# EAGLE design R650X (EAGLE 6.6.0)
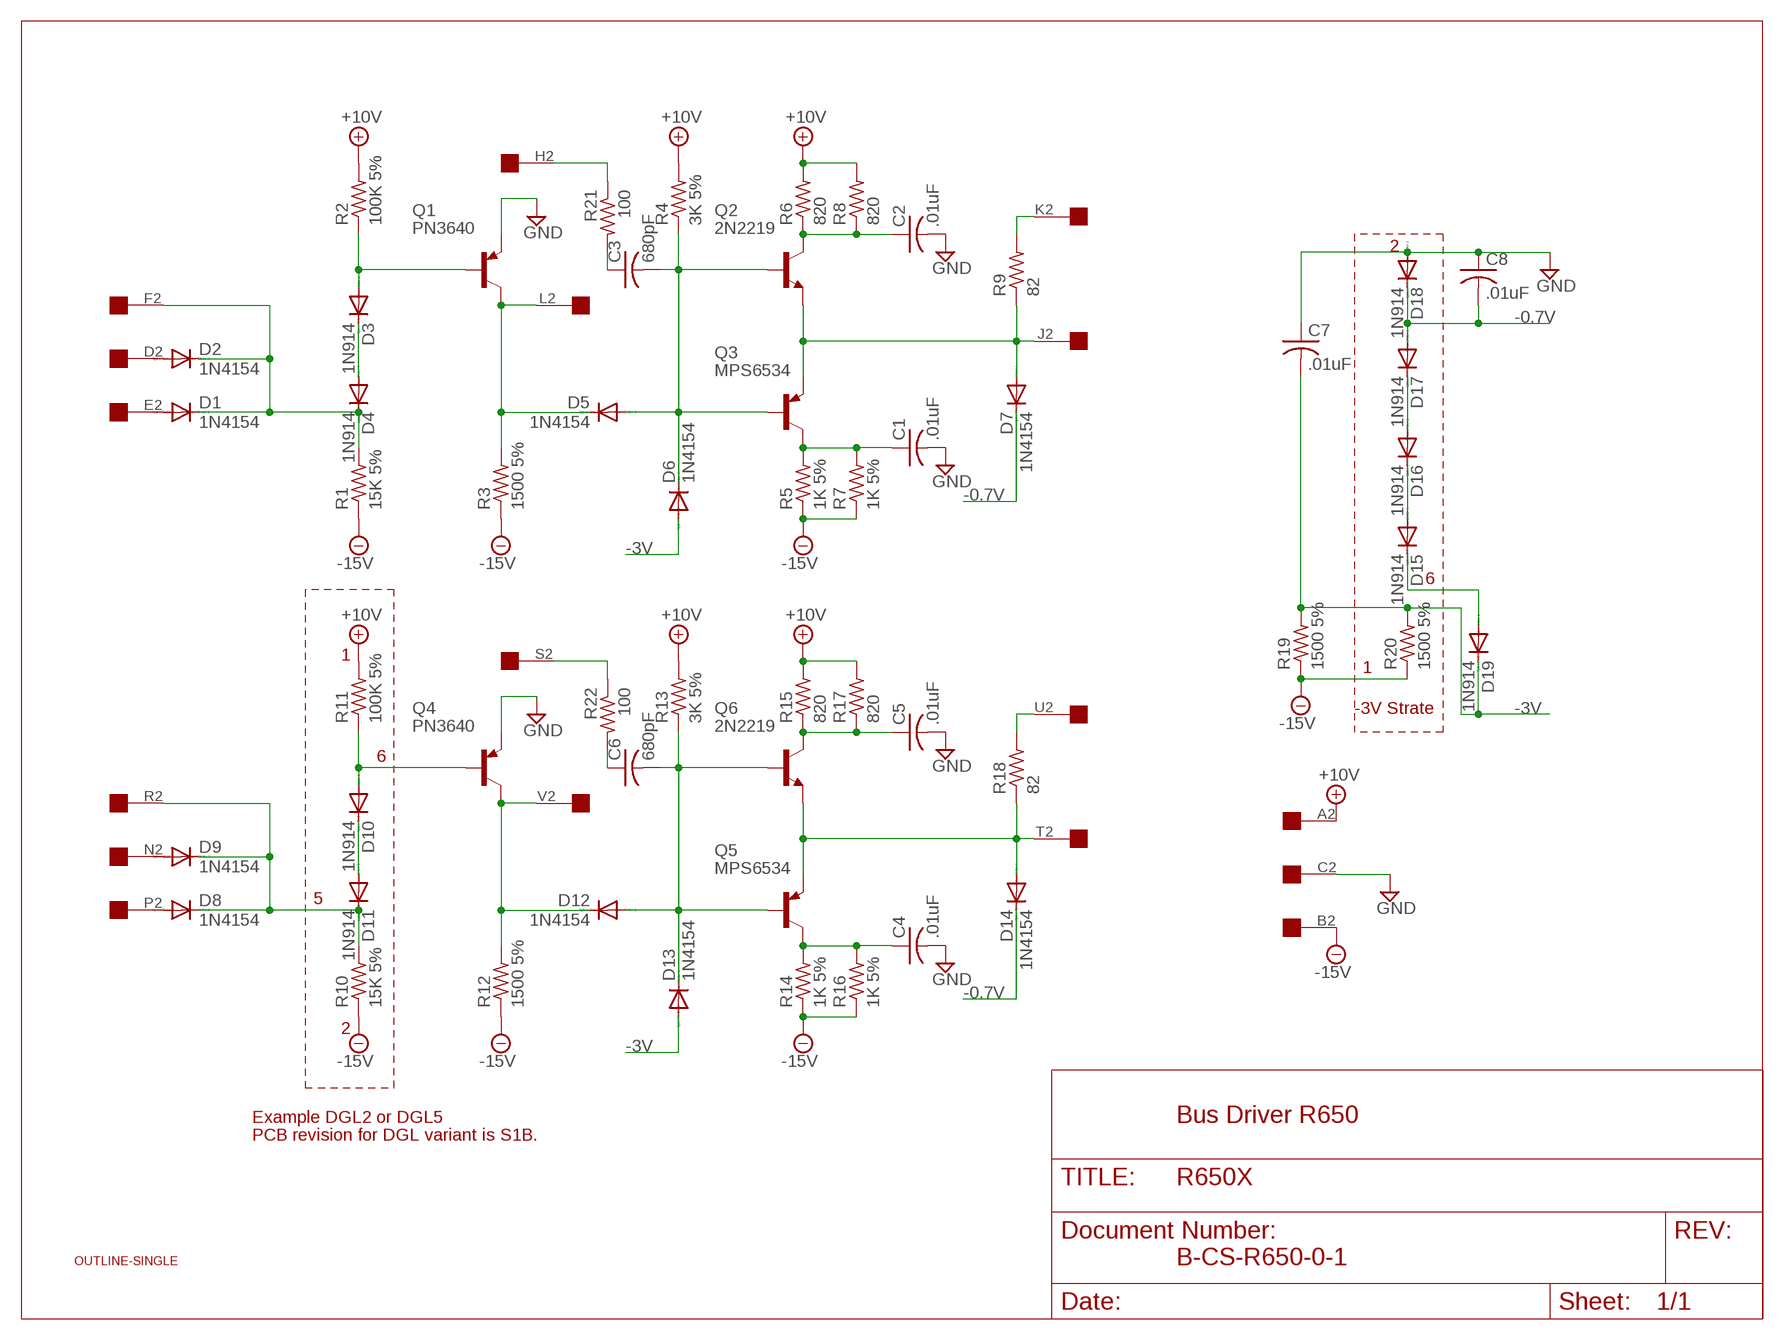
[diagram p0: schematic, sheet 1]

## Parts
C1  .01uF  C-US102-043X133  [C102-043X133]
C2  .01uF  C-US102-043X133  [C102-043X133]
C3  680pF  C-US102-043X133  [C102-043X133]
C4  .01uF  C-US102-043X133  [C102-043X133]
C5  .01uF  C-US102-043X133  [C102-043X133]
C6  680pF  C-US102-043X133  [C102-043X133]
C7  .01uF  C-US102-043X133  [C102-043X133]
C8  .01uF  C-US102-043X133  [C102-043X133]
D1  1N4154  1N4148DO35-10  [DO35-10]
D2  1N4154  1N4148DO35-10  [DO35-10]
D3  1N914  1N4148DO35-10  [DO35-10]
D4  1N914  1N4148DO35-10  [DO35-10]
D5  1N4154  1N4148DO35-10  [DO35-10]
D6  1N4154  1N4148DO35-10  [DO35-10]
D7  1N4154  1N4148DO35-10  [DO35-10]
D8  1N4154  1N4148DO35-10  [DO35-10]
D9  1N4154  1N4148DO35-10  [DO35-10]
D10  1N914  1N4148DO35-10  [DO35-10]
D11  1N914  1N4148DO35-10  [DO35-10]
D12  1N4154  1N4148DO35-10  [DO35-10]
D13  1N4154  1N4148DO35-10  [DO35-10]
D14  1N4154  1N4148DO35-10  [DO35-10]
D15  1N914  1N4148DO35-10  [DO35-10]
D16  1N914  1N4148DO35-10  [DO35-10]
D17  1N914  1N4148DO35-10  [DO35-10]
D18  1N914  1N4148DO35-10  [DO35-10]
D19  1N914  1N4148DO35-10  [DO35-10]
Q1  PN3640  2N3637  [TO39]
Q2  2N2219  [TO5]
Q3  MPS6534  2N3637  [TO39]
Q4  PN3640  2N3637  [TO39]
Q5  MPS6534  2N3637  [TO39]
Q6  2N2219  [TO5]
R1  15K 5%  R-US_0207/10  [0207/10]
R2  100K 5%  R-US_0207/10  [0207/10]
R3  1500 5%  R-US_0207/10  [0207/10]
R4  3K 5%  R-US_0207/10  [0207/10]
R5  1K 5%  R-US_0207/10  [0207/10]
R6  820  R-US_0207/10  [0207/10]
R7  1K 5%  R-US_0207/10  [0207/10]
R8  820  R-US_0207/10  [0207/10]
R9  82  R-US_0207/10  [0207/10]
R10  15K 5%  R-US_0207/10  [0207/10]
R11  100K 5%  R-US_0207/10  [0207/10]
R12  1500 5%  R-US_0207/10  [0207/10]
R13  3K 5%  R-US_0207/10  [0207/10]
R14  1K 5%  R-US_0207/10  [0207/10]
R15  820  R-US_0207/10  [0207/10]
R16  1K 5%  R-US_0207/10  [0207/10]
R17  820  R-US_0207/10  [0207/10]
R18  82  R-US_0207/10  [0207/10]
R19  1500 5%  R-US_0207/10  [0207/10]
R20  1500 5%  R-US_0207/10  [0207/10]
R21  100  R-US_0207/10  [0207/10]
R22  100  R-US_0207/10  [0207/10]
U$1  OUTLINE-SINGLE  [SINGLE]
U$2  EDGE-1  [EDGE-CON1]

## Nets
+10V [Power]: R2.2 R4.2 R6.2 R8.2 R11.2 R13.2 R15.2 R17.2 U$2.A2
-0.7V [Power]: C8.2 D7.C D14.C D17.A D18.C
-3V [Power]: C7.2 D6.A D13.A D19.C R19.2 R20.2
-15V [Power]: R1.1 R3.1 R5.1 R7.1 R10.1 R12.1 R14.1 R16.1 R19.1 R20.1 U$2.B2
GND [Power]: C1.2 C2.2 C4.2 C5.2 C7.1 C8.1 D18.A Q1.1(E) Q4.1(E) U$2.C2
N$1: C3.2 D5.A D6.C Q2.2(B) Q3.2(B) R4.1
N$2: D7.A Q2.1(E) Q3.1(E) R9.1 U$2.J2
N$3: R9.2 U$2.K2
N$5: D5.C Q1.3(C) R3.2 U$2.L2
N$6: C2.1 Q2.3(C) R6.1 R8.1
N$7: C1.1 Q3.3(C) R5.2 R7.2
N$8: D10.A Q4.2(B) R11.1
N$9: D12.C Q4.3(C) R12.2 U$2.V2
N$10: D8.C D9.C D11.C R10.2 U$2.R2
N$11: D10.C D11.A
N$13: D16.A D17.C
N$14: R21.1 U$2.H2
N$15: C3.1 R21.2
N$16: D15.A D16.C
N$17: C6.2 D12.A D13.C Q5.2(B) Q6.2(B) R13.1
N$18: D14.A Q5.1(E) Q6.1(E) R18.1 U$2.T2
N$19: D3.A Q1.2(B) R2.1
N$21: D1.A U$2.E2
N$22: D1.C D2.C D4.C R1.2 U$2.F2
N$23: D3.C D4.A
N$25: C5.1 Q6.3(C) R15.1 R17.1
N$26: C4.1 Q5.3(C) R14.2 R16.2
N$27: R18.2 U$2.U2
N$28: R22.1 U$2.S2
N$29: C6.1 R22.2
N$30: D9.A U$2.N2
N$31: D8.A U$2.P2
N$34: D15.C D19.A
N$39: D2.A U$2.D2
Unconnected: U$2.M2

## Notes on the sheet
- 2
- 6
- 1 | 1
- -3V Strate
- 6
- 5
- 2
- Example DGL2 or DGL5 | Bus Driver R650
- PCB revision for DGL variant is S1B.
- B-CS-R650-0-1

## Library data of the parts
C1-C8 = rcl:C-US: CAPACITOR, American symbol
D1-D19 = diode:1N4148: DIODE high speed (Philips)
Q1 Q3-Q5 = transistor-pnp:2N3637*: PNP Transistror
Q2 Q6 = transistor:2N2219: NPN TRANSISTOR
R1-R22 = rcl:R-US_: RESISTOR, American symbol
U$1 = dec-con:OUTLINE-*: Board outlines for DEC boards.
U$2 = dec-con:EDGE-1: Single-Sided DEC Edge Connector -- (side 2)

## Net classes
1 Power: width 0.813 mm

## Board
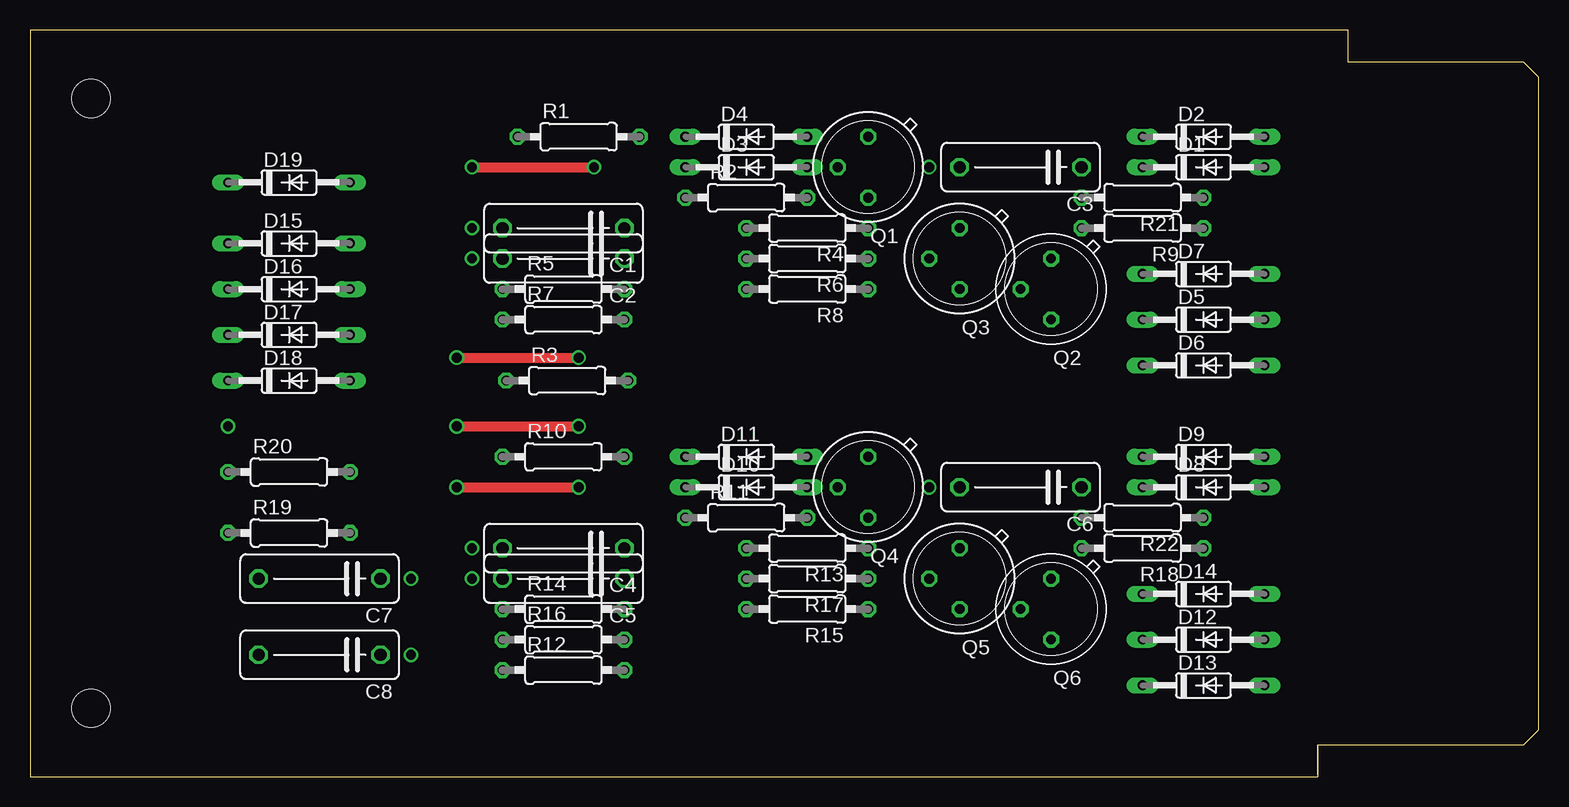
[diagram p1: board, top side]
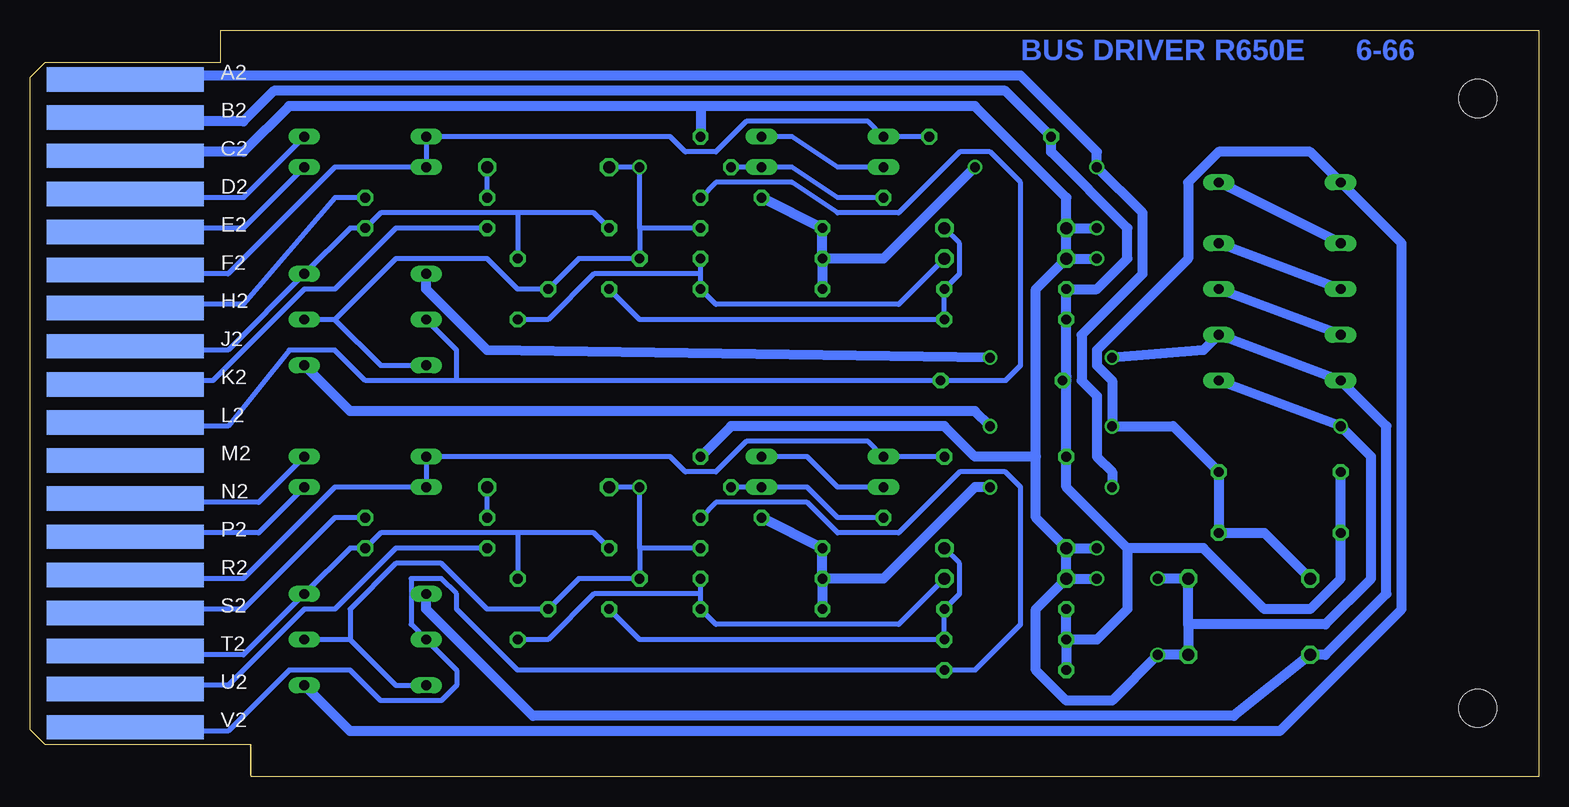
[diagram p2: board, bottom side, seen from below]

Size 125.73 x 62.23 mm. Coordinates in mm from the lower left corner, seen from the top.
Copper layers (1+16): Top 0.035mm / dielectric 1.5mm / Bottom 0.035mm
Design rules "16mils": minimum track width 16mil, minimum drill 32mil, track to track 15mil, track to pad 10mil, pad to pad 10mil, via to via 10mil, smd to smd 10mil, copper to edge 13mil, drill to drill 10mil, minimum pad ring 10mil, minimum via ring 8mil, stop-mask expansion 0mil, vias tented up to drill 0mil, thermal gap 10mil

### Footprints (pad centres in the part's own frame; a part is rotated, then mirrored left to right if it is on the bottom)
C102-043X133 = drill 1.016 octagon: 1 -5.08,0; 2 5.08,0
DO35-10 = drill 0.813 long: A 5.08,0; C -5.08,0
TO39 = drill 0.813 octagon: 1 0,-2.54; 2 2.54,0; 3 0,2.54
TO5 = drill 0.813 octagon: 1 0,-2.54; 2 2.54,0; 3 0,2.54
0207/10 = drill 0.813 octagon: 1 -5.08,0; 2 5.08,0
SINGLE = hole 3.175: 120.65,56.515; 120.65,5.715
EDGE-CON1 = smd 13.106 x 2.032 bottom: A2 7.938,4.128; B2 7.938,7.303; C2 7.938,10.477; D2 7.938,13.652; E2 7.938,16.828; F2 7.938,20.003; H2 7.938,23.177; J2 7.938,26.352; K2 7.938,29.527; L2 7.938,32.703; M2 7.938,35.877; N2 7.938,39.053; P2 7.938,42.227; R2 7.938,45.403; S2 7.938,48.578; T2 7.938,51.752; U2 7.938,54.928; V2 7.938,58.102

### Placement (x,y rotation side)
C1  44.45,45.72 180 top
C2  44.45,43.18 180 top
C3  82.55,50.8 180 top
C4  44.45,19.05 180 top
C5  44.45,16.51 180 top
C6  82.55,24.13 180 top
C7  24.13,16.51 180 top
C8  24.13,10.16 180 top
D1  97.79,50.8 0 top
D2  97.79,53.34 0 top
D3  59.69,50.8 0 top
D4  59.69,53.34 0 top
D5  97.79,38.1 0 top
D6  97.79,34.29 0 top
D7  97.79,41.91 0 top
D8  97.79,24.13 0 top
D9  97.79,26.67 0 top
D10  59.69,24.13 0 top
D11  59.69,26.67 0 top
D12  97.79,11.43 0 top
D13  97.79,7.62 0 top
D14  97.79,15.24 0 top
D15  21.59,44.45 0 top
D16  21.59,40.64 0 top
D17  21.59,36.83 0 top
D18  21.59,33.02 0 top
D19  21.59,49.53 0 top
Q1  69.85,50.8 180 top
Q2  85.09,40.64 180 top
Q3  77.47,43.18 180 top
Q4  69.85,24.13 180 top
Q5  77.47,16.51 180 top
Q6  85.09,13.97 180 top
R1  45.72,53.34 0 top
R2  59.69,48.26 0 top
R3  44.77,33.02 0 top
R4  64.77,45.72 180 top
R5  44.45,40.64 0 top
R6  64.77,43.18 180 top
R7  44.45,38.1 0 top
R8  64.77,40.64 180 top
R9  92.71,45.72 180 top
R10  44.45,26.67 0 top
R11  59.69,21.59 0 top
R12  44.45,8.89 0 top
R13  64.77,19.05 180 top
R14  44.45,13.97 0 top
R15  64.77,13.97 180 top
R16  44.45,11.43 0 top
R17  64.77,16.51 180 top
R18  92.71,19.05 180 top
R19  21.59,20.32 0 top
R20  21.59,25.4 0 top
R21  92.71,48.26 180 top
R22  92.71,21.59 180 top
U$1  125.73,62.23 180 top
U$2  125.73,62.23 180 top

### Tracks (layer width: path | path; a pad name or v marks a point on that pad's centre or on a via)
+10V  (via drill 0.81)
  Top 0.813: v36.83,50.8 v46.99,50.8 | v35.56,24.13 v45.72,24.13
  Bottom 0.813: R2.2 R4.2 R6.2 | R6.2 R8.2 | U$2.A2 116.84,58.42 43.18,58.42 36.83,52.07 v36.83,50.8 33.02,46.99 33.02,41.91 38.1,36.83 38.1,33.02 36.83,31.75 36.83,26.67 35.56,25.4 v35.56,24.13 | v46.99,50.8 54.61,43.18 R6.2 | R11.2 R13.2 R17.2 | R17.2 R15.2 | v45.72,24.13 46.99,24.13 54.61,16.51 R17.2
-0.7V  (via drill 0.81)
  Top 0.813: v35.56,34.92 v45.72,34.92
  Bottom 0.813: v35.56,34.92 27.94,35.56 D17.A D18.C 12.7,29.21 12.7,15.24 17.78,10.16 C8.2 25.4,5.08 83.82,5.08 92.71,13.97 D14.C | v45.72,34.92 87.63,35.56 92.71,40.64 D7.C
-3V  (via drill 0.81)
  Top 0.813: v35.56,29.21 v45.72,29.21
  Bottom 0.813: C7.2 22.86,20.32 R19.2 R20.2 30.48,29.21 v35.56,29.21 35.56,33.02 36.83,34.29 36.83,35.56 29.21,43.18 29.21,49.53 26.67,52.07 19.05,52.07 D19.C 11.43,44.45 11.43,13.97 21.59,3.81 99.06,3.81 D13.A | v45.72,29.21 46.99,30.48 99.06,30.48 D6.A
-15V
  Bottom 0.813: U$2.B2 116.84,54.61 107.95,54.61 105.41,57.15 44.45,57.15 R1.1 40.64,52.07 34.29,45.72 34.29,43.18 36.83,40.64 R5.1 R7.1 39.37,33.34 R3.1 39.37,33.02 R10.1 39.37,24.13 34.29,19.05 | R16.1 R12.1 | R16.1 R14.1 | R16.1 36.83,11.43 34.29,13.97 34.29,19.05 | R20.1 R19.1 16.51,16.51 19.05,13.97 22.86,13.97 27.94,19.05 34.29,19.05
GND  (via drill 0.81)
  Bottom 0.813: U$2.C2 116.84,52.07 107.95,52.07 104.14,55.88 69.85,55.88 | 69.85,55.88 46.99,55.88 39.37,48.26 C1.2 | 69.85,55.88 Q1.1 | C1.2 v36.83,45.72 | C2.2 v36.83,43.18 | C2.2 C1.2 | C4.2 v36.83,19.05 | C5.2 v36.83,16.51 | C5.2 C4.2 | 29.21,12.7 17.78,12.7 13.97,16.51 13.97,26.67 v16.51,29.21 D18.A | 29.21,12.7 C8.1 | 29.21,12.7 C7.1 v31.75,16.51 | C8.1 v31.75,10.16 | v31.75,10.16 35.56,6.35 39.37,6.35 41.91,8.89 41.91,13.97 C5.2 | C2.2 41.91,40.64 41.91,26.67 | 41.91,26.67 41.91,21.59 C4.2 | Q4.1 67.31,29.21 49.53,29.21 46.99,26.67 41.91,26.67 | C8.1 v31.75,10.16
N$1  (via drill 0.81)
  Bottom 0.406: C3.2 v74.93,50.8 74.93,45.72 | R4.1 74.93,45.72 | 74.93,45.72 Q3.2 80.01,43.18 Q2.2 85.09,40.64 87.63,43.18 95.25,43.18 100.33,38.1 | 100.33,38.1 D5.A | D6.C 96.52,34.29 100.33,38.1
N$2
  Bottom 0.406: U$2.J2 117.17,35.89 116.84,35.56 109.22,35.56 D7.A 99.06,45.72 R9.1 96.52,46.99 85.09,46.99 | 85.09,46.99 78.74,46.99 Q3.1 | 85.09,46.99 Q2.1
N$3
  Bottom 0.406: U$2.K2 115.88,32.71 115.57,33.02 110.49,33.02 102.87,40.64 100.33,40.64 95.25,45.72 R9.2
N$5
  Bottom 0.406: Q1.3 68.58,49.53 62.23,49.53 58.42,46.99 53.34,46.99 48.26,52.07 45.72,52.07 43.18,49.53 43.18,34.29 44.45,33.02 R3.2 90.17,33.02 | 90.17,33.02 90.17,35.56 D5.C | U$2.L2 115.57,29.21 109.22,29.21 104.14,35.56 100.33,35.56 97.79,33.02 90.17,33.02
N$6
  Bottom 0.406: R8.1 R6.1 | R8.1 69.85,41.91 78.74,41.91 82.55,38.1 Q2.3 | C2.1 53.34,39.37 68.58,39.37 R8.1
N$7
  Bottom 0.406: C1.1 48.26,44.45 48.26,41.91 R5.2 R7.2 74.93,38.1 Q3.3
N$8
  Bottom 0.406: Q4.2 D10.A 60.96,24.13 58.42,21.59 R11.1
N$9
  Bottom 0.406: Q4.3 68.58,22.86 60.96,22.86 58.42,20.32 53.34,20.32 48.26,25.4 44.45,25.4 43.18,24.13 43.18,12.7 46.99,8.89 R12.2 85.09,8.89 90.17,13.97 90.17,15.24 91.44,16.51 93.98,16.51 93.98,12.7 D12.C 90.17,8.89 90.17,7.62 91.44,6.35 96.52,6.35 99.06,8.89 104.14,8.89 109.22,3.81 115.57,3.81 U$2.V2
N$10
  Bottom 0.406: U$2.R2 117.17,16.84 116.84,16.51 107.95,16.51 100.33,24.13 D8.C D9.C 72.39,26.67 71.12,25.4 68.58,25.4 66.04,27.94 55.88,27.94 D11.C R10.2
N$11
  Bottom 0.406: D10.C 58.42,24.13 60.96,26.67 D11.A
N$13
  Bottom 0.813: D17.C D16.A
N$14
  Bottom 0.406: U$2.H2 115.9,39.04 115.57,39.37 107.95,39.37 100.33,48.26 R21.1
N$15
  Bottom 0.406: R21.2 C3.1
N$16
  Bottom 0.813: D16.C D15.A
N$17  (via drill 0.81)
  Bottom 0.406: C6.2 v74.93,24.13 74.93,19.05 | 74.93,19.05 Q5.2 80.01,16.51 Q6.2 87.63,13.97 91.44,17.78 95.25,17.78 99.06,13.97 99.06,11.43 | R13.1 74.93,19.05 | D13.C 95.25,7.62 99.06,11.43 | 99.06,11.43 D12.A
N$18
  Bottom 0.406: 85.09,20.32 Q6.1 | U$2.T2 116.84,10.16 107.95,10.16 D14.A 99.06,19.05 R18.1 96.52,20.32 85.09,20.32 | 85.09,20.32 78.74,20.32 Q5.1
N$19
  Bottom 0.406: R2.1 58.42,48.26 62.23,50.8 D3.A Q1.2
N$21
  Bottom 0.406: U$2.E2 117.17,45.39 116.84,45.72 107.95,45.72 108.57,45.71 107.96,45.71 D1.A
N$22
  Bottom 0.406: U$2.F2 117.12,42.19 116.84,41.91 109.22,41.91 100.33,50.8 D1.C D2.C 72.39,53.34 71.12,52.07 68.58,52.07 66.04,54.61 55.88,54.61 D4.C R1.2
N$23
  Bottom 0.406: D3.C 58.42,50.8 62.23,53.34 D4.A
N$25
  Bottom 0.406: Q6.3 82.55,11.43 78.74,15.24 69.85,15.24 | 69.85,15.24 R15.1 68.58,12.7 53.34,12.7 C5.1 | 69.85,15.24 R17.1
N$26
  Bottom 0.406: Q5.3 74.93,11.43 R16.2 R14.2 48.26,15.24 48.26,17.78 C4.1
N$27
  Bottom 0.406: U$2.U2 116.84,7.62 109.22,7.62 102.87,13.97 100.33,13.97 95.25,19.05 R18.2
N$28
  Bottom 0.406: U$2.S2 115.88,13.66 115.57,13.97 107.95,13.97 102.87,19.05 100.33,21.59 R22.1
N$29
  Bottom 0.406: R22.2 C6.1
N$30
  Bottom 0.406: U$2.N2 117.17,23.19 116.84,22.86 106.68,22.86 D9.A
N$31
  Bottom 0.406: U$2.P2 117.17,19.99 116.84,20.32 106.68,20.32 D8.A
N$34
  Bottom 0.813: D15.C D19.A
N$39
  Bottom 0.406: U$2.D2 116.84,48.56 116.84,48.26 107.95,48.26 D2.A

### Text on the board
Bottom: 6-66 | BUS DRIVER R650E